# EAGLE design CC Debugger Adapter v1.0 (EAGLE 6.3)
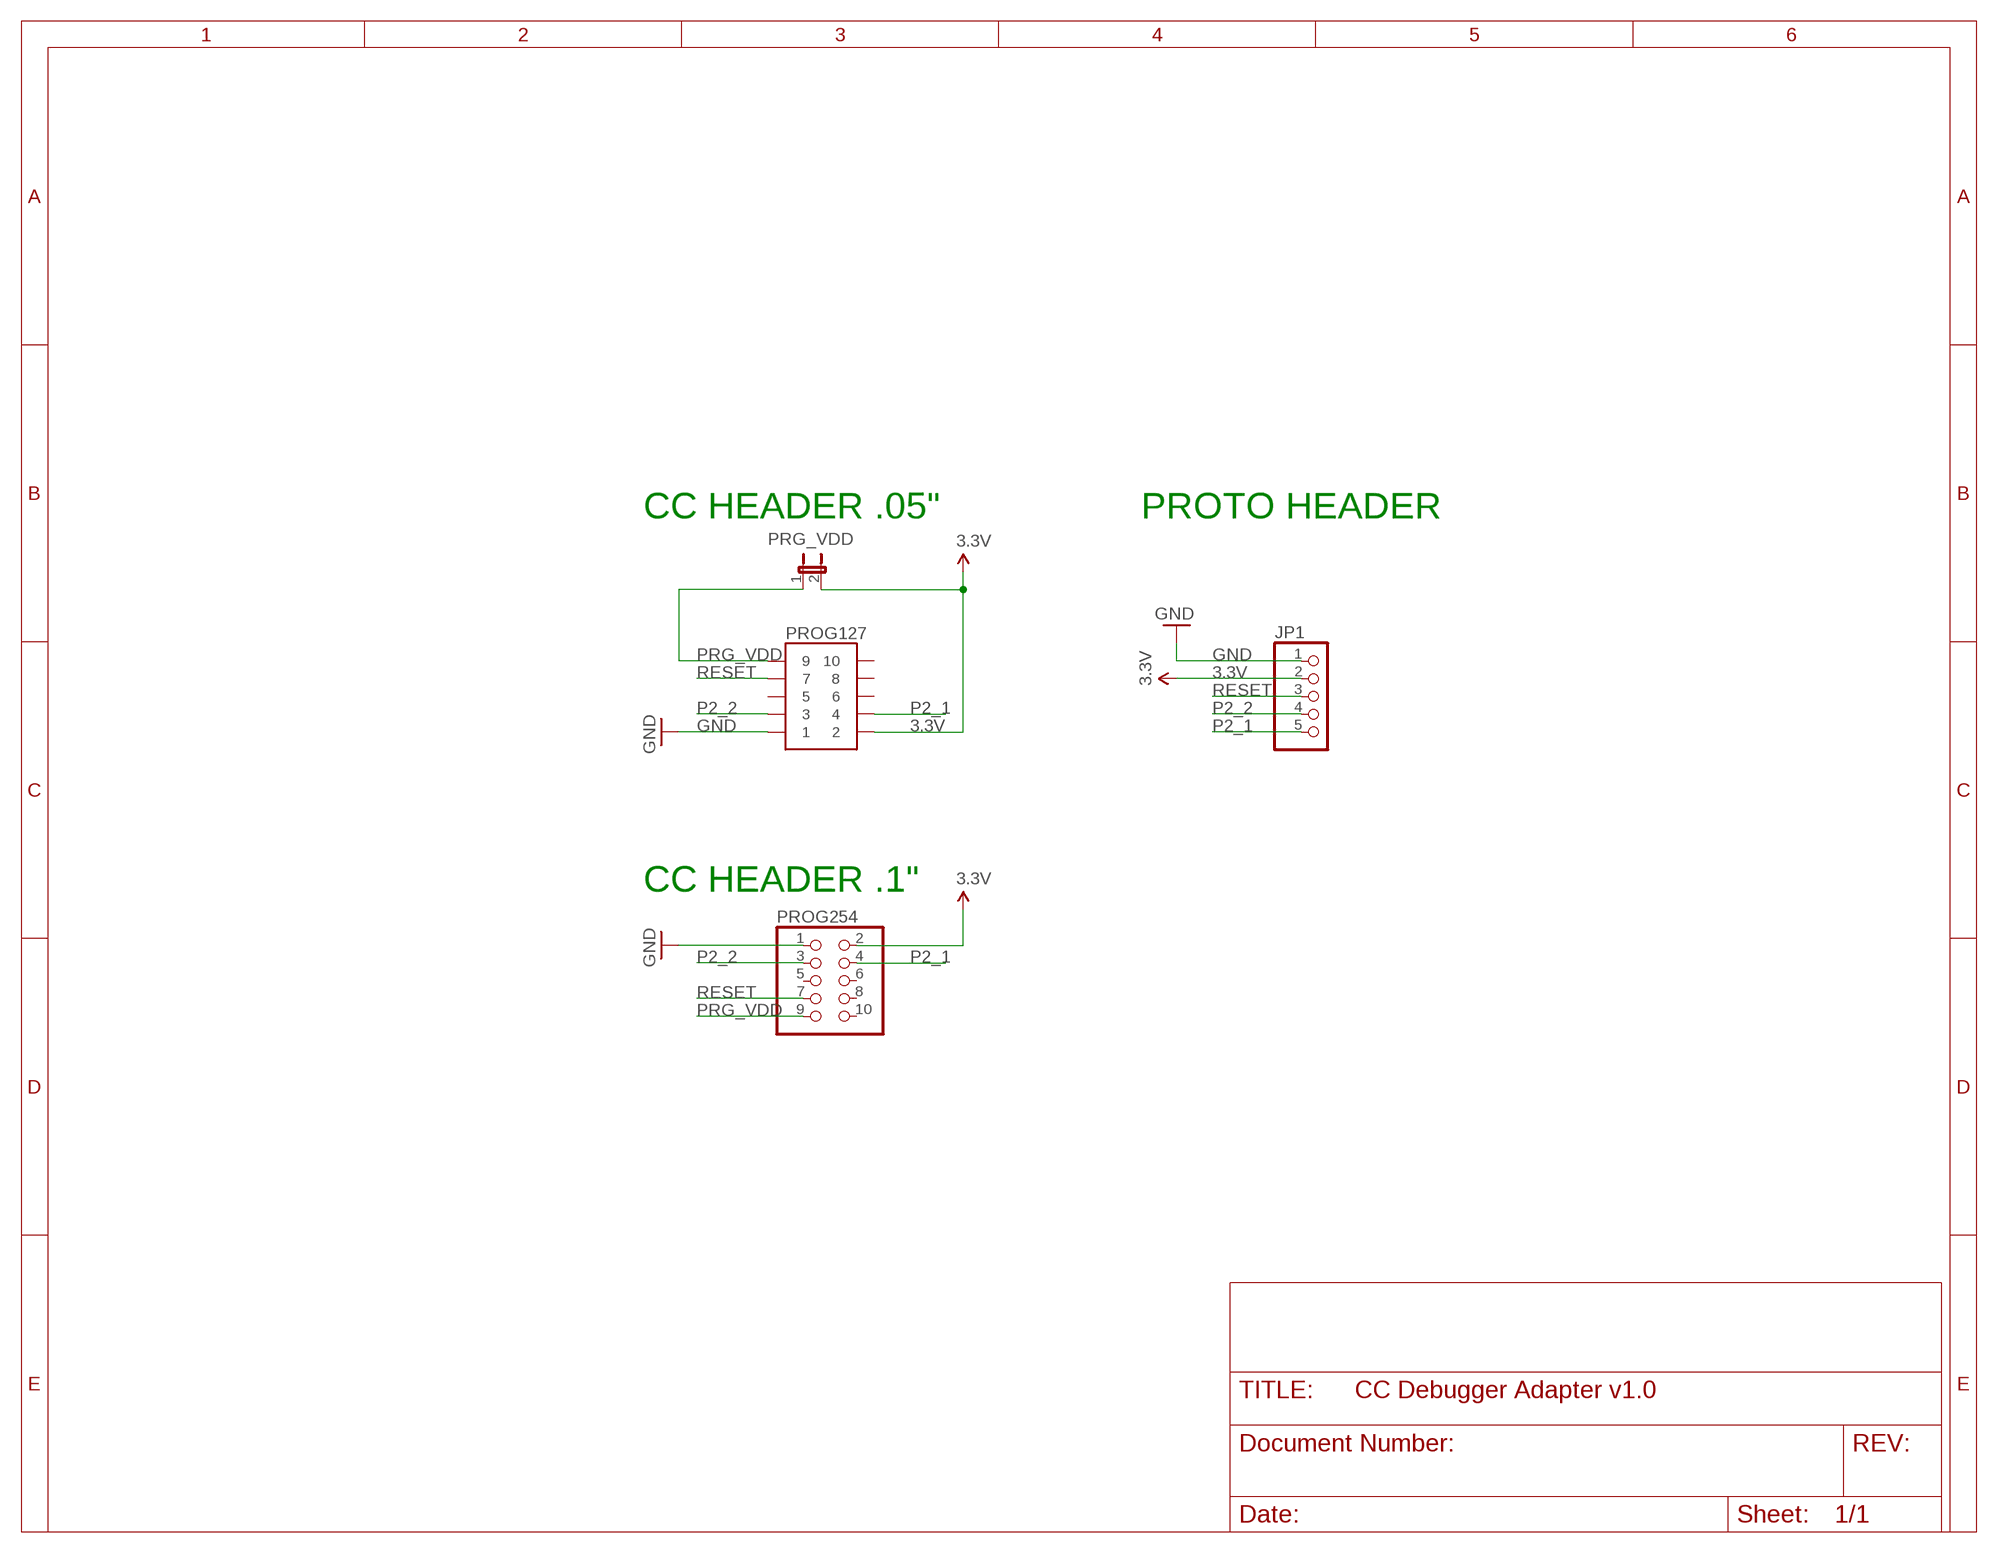
[diagram p0: schematic, sheet 1]

## Parts
JP1  PINHD-1X5  [1X05]
PRG_VDD  JUMPER-2PTH  [1X02]
PROG127  CONN_5-2-FTSH-V  [FTSH-105-DV]
PROG254  HEADER-2X5  [2X05]

## Nets
3.3V [power]: JP1.2 PRG_VDD.2 PROG127.2 PROG254.2
GND [power]: JP1.1 PROG127.1 PROG254.1
P2_1: JP1.5 PROG127.4 PROG254.4
P2_2: JP1.4 PROG127.3 PROG254.3
PRG_VDD [power]: PRG_VDD.1 PROG127.9 PROG254.9
RESET: JP1.3 PROG127.7 PROG254.7
Unconnected: PROG127.5 PROG127.6 PROG127.8 PROG127.10 PROG254.5 PROG254.6 PROG254.8 PROG254.10

## Notes on the sheet
- CC HEADER .05" | PROTO HEADER
- CC HEADER .1"

## Library data of the parts
JP1 = sf-pinhead:PINHD-1X5: PIN HEADER
PRG_VDD = SparkFun:JUMPER-2: Jumper Basic 0.1" spaced jumper. Use with breakaway headers.
PROG127 = pel_misc:CONN_5-2
PROG254 = nonolith:HEADER-2X5: PIN HEADER

## Net classes
0 default: width 0.254 mm, drill 0.33 mm, clearance 0.152 mm
1 power: width 0.254 mm, drill 0.33 mm, clearance 0.152 mm

## Board
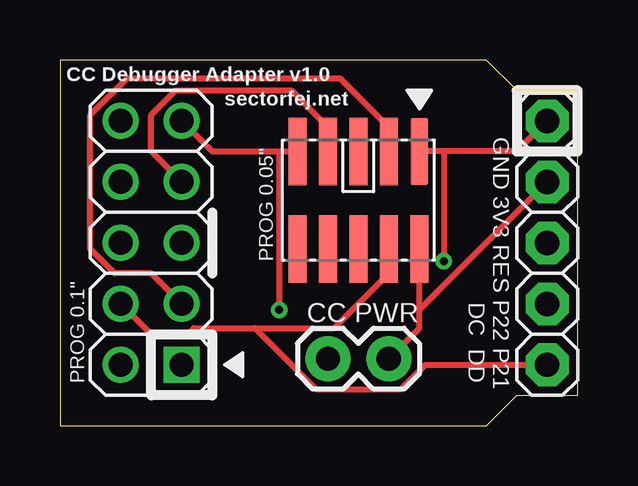
[diagram p1: board, top side]
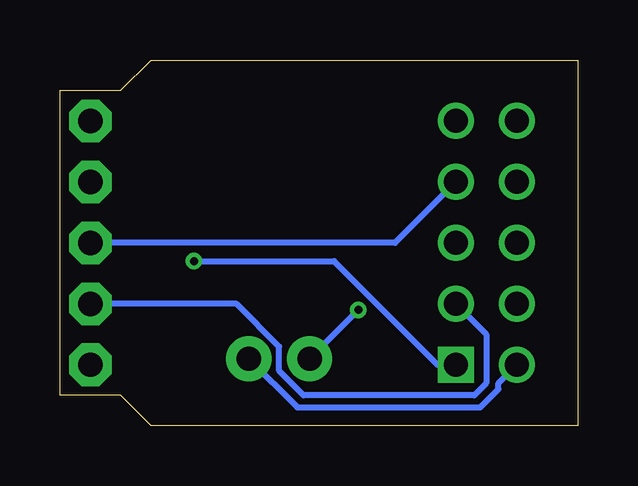
[diagram p2: board, bottom side, seen from below]

Size 21.59 x 15.24 mm. Coordinates in mm from the lower left corner, seen from the top.
Outline: 0,0 17.78,0 19.05,1.27 21.59,1.27 21.59,13.97 19.05,13.97 17.78,15.24 0,15.24 0,0
Copper layers (1*16): Top 0.0356mm / dielectric 1.5011mm / Bottom 0.0356mm
Design rules "default": minimum track width 6mil, minimum drill 13mil, track to track 6mil, track to pad 6mil, pad to pad 6mil, via to via 6mil, smd to smd 6mil, copper to edge 15mil, drill to drill 6mil, minimum pad ring 7mil, minimum via ring 7mil, stop-mask expansion 4mil, vias tented up to drill 13mil, thermal gap 10mil

### Footprints (pad centres in the part's own frame; a part is rotated, then mirrored left to right if it is on the bottom)
1X05 = drill 1.016 pad 1.778 octagon: 1 -5.08,0; 2 -2.54,0; 3 0,0; 4 2.54,0; 5 5.08,0
1X02 = drill 1.016 pad 1.88: 1 0,0; 2 2.54,0
FTSH-105-DV = smd 0.74 x 2.8: 1 -2.54,-2.03; 2 -2.54,2.03; 3 -1.27,-2.03; 4 -1.27,2.03; 5 0,-2.03; 6 0,2.03; 7 1.27,-2.03; 8 1.27,2.03; 9 2.54,-2.03; 10 2.54,2.03
2X05 = drill 1 square: 1 -5.08,-1.27 | drill 1: 2 -5.08,1.27; 3 -2.54,-1.27; 4 -2.54,1.27; 5 0,-1.27; 6 0,1.27; 7 2.54,-1.27; 8 2.54,1.27; 9 5.08,-1.27; 10 5.08,1.27

### Placement (x,y rotation side)
JP1  20.32,7.62 270 top
PRG_VDD  11.18,2.79 0 top
PROG127  12.45,9.4 180 top
PROG254  3.81,7.62 90 top

### Tracks (layer width: path | path; a pad name or v marks a point on that pad's centre or on a via)
3.3V
  Top 0.254: 14.99,4.83 14.99,4.06 PRG_VDD.2 | 14.99,4.83 PROG127.2 | 14.99,4.83 JP1.2
  Bottom 0.254: PROG254.2 3.3,1.78 3.3,1.52 4.06,0.76 11.68,0.76 PRG_VDD.2
GND  (via drill 0.33)
  Top 0.254: 16,11.43 19.05,11.43 JP1.1 | 16,11.43 PROG127.1 | 16,11.43 v16,6.86
  Bottom 0.254: PROG254.1 5.84,2.54 10.16,6.86 v16,6.86
P2_1
  Top 0.254: PROG127.4 13.72,6.35 11.43,4.06 8.13,4.06 | 8.13,4.06 5.59,4.06 5.33,3.81 3.81,3.81 PROG254.4 | JP1.5 15.24,2.54 14.22,1.52 10.67,1.52 8.13,4.06
P2_2
  Top 0.254: PROG127.3 13.72,12.45 11.68,14.48 2.79,14.48 1.27,12.95 1.27,7.37 2.29,6.35 3.81,6.35 PROG254.3
  Bottom 0.254: JP1.4 14.22,5.08 12.45,3.3 12.45,2.29 11.43,1.27 4.32,1.27 3.81,1.78 3.81,3.81 PROG254.3
PRG_VDD  (via drill 0.33)
  Top 0.254: 9.14,11.43 6.35,11.43 PROG254.9 | 9.14,11.43 PROG127.9 | 9.14,11.43 v9.14,4.83
  Bottom 0.254: v9.14,4.83 PRG_VDD.1
RESET
  Top 0.254: PROG127.7 11.18,12.45 9.65,13.97 4.83,13.97 3.81,12.95 3.81,11.43 PROG254.7
  Bottom 0.254: JP1.3 7.62,7.62 PROG254.7

### Text on the board
tPlace: CC Debugger Adapter v1.0 | sectorfej.net | PROG 0.05" | CC PWR | PROG 0.1" | GND 3V3 RES P22 P21 / DC DD